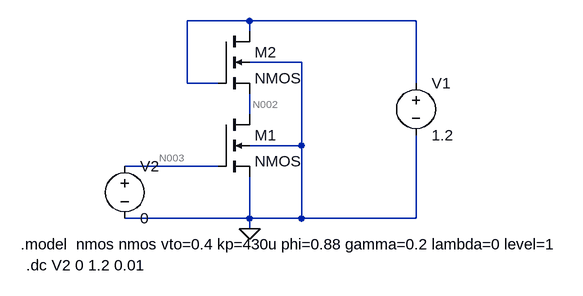
[diagram p0: schematic Lab02Part4.asc]
Lab02Part4.asc, the LTspice schematic file:
Version 4
SHEET 1 880 680
WIRE 176 0 80 0
WIRE 432 0 176 0
WIRE 176 16 176 0
WIRE 256 64 176 64
WIRE 80 96 80 0
WIRE 128 96 80 96
WIRE 432 96 432 0
WIRE 176 144 176 112
WIRE 256 192 256 64
WIRE 256 192 176 192
WIRE 128 224 -16 224
WIRE 176 304 176 240
WIRE 176 304 -16 304
WIRE 256 304 256 192
WIRE 256 304 176 304
WIRE 432 304 432 176
WIRE 432 304 256 304
WIRE 176 320 176 304
FLAG 176 320 0
SYMBOL nmos4 128 16 R0
SYMATTR InstName M2
SYMATTR Value2 l=0.25u w=5u
SYMBOL nmos4 128 144 R0
SYMATTR InstName M1
SYMATTR Value2 l=0.25u w=100u
SYMBOL voltage 432 80 R0
WINDOW 123 0 0 Left 0
WINDOW 39 0 0 Left 0
SYMATTR InstName V1
SYMATTR Value 1.2
SYMBOL voltage -16 208 R0
WINDOW 123 0 0 Left 0
WINDOW 39 0 0 Left 0
SYMATTR InstName V2
SYMATTR Value 0
TEXT -176 344 Left 2 !.model  nmos nmos vto=0.4 kp=430u phi=0.88 gamma=0.2 lambda=0 level=1
TEXT -168 376 Left 2 !.dc V2 0 1.2 0.01

The netlist it stands for:
* Lab02Part4.asc
M2 N001 N001 N002 0 NMOS l=0.25u w=5u
M1 N002 N003 0 0 NMOS l=0.25u w=100u
V1 N001 0 1.2
V2 N003 0 0
.model NMOS NMOS
.model PMOS PMOS
.lib standard.mos
.model  nmos nmos vto=0.4 kp=430u phi=0.88 gamma=0.2 lambda=0 level=1
.dc V2 0 1.2 0.01
.backanno
.end

* Results of the author's LTspice run, read from the files saved beside the schematic
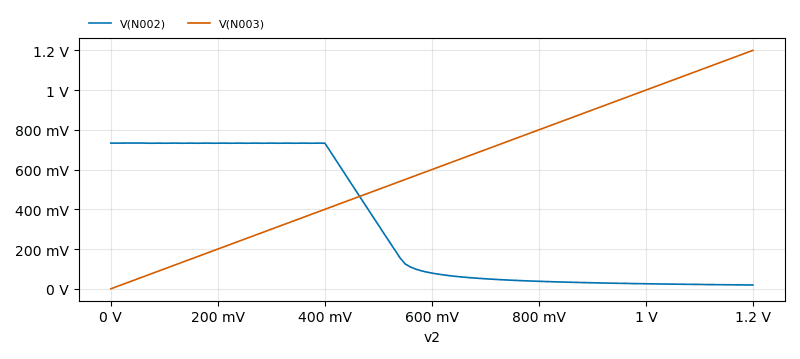
[diagram p1: DC transfer characteristic of Lab02Part4.asc, plotted from the saved traces]
* DC transfer characteristic, 1 run:
*   V(N002): 733.1 mV at v2=0 V, 19.18 mV at v2=1.2 V, min 19.18 mV, max 733.5 mV
*   V(N003): 0 V at v2=0 V, 1.2 V at v2=1.2 V, min 0 V, max 1.2 V